# EAGLE design app_out_8x_16A_bistab_seperated_4MU_BOT_v1.0.0 (EAGLE 7.2.0)
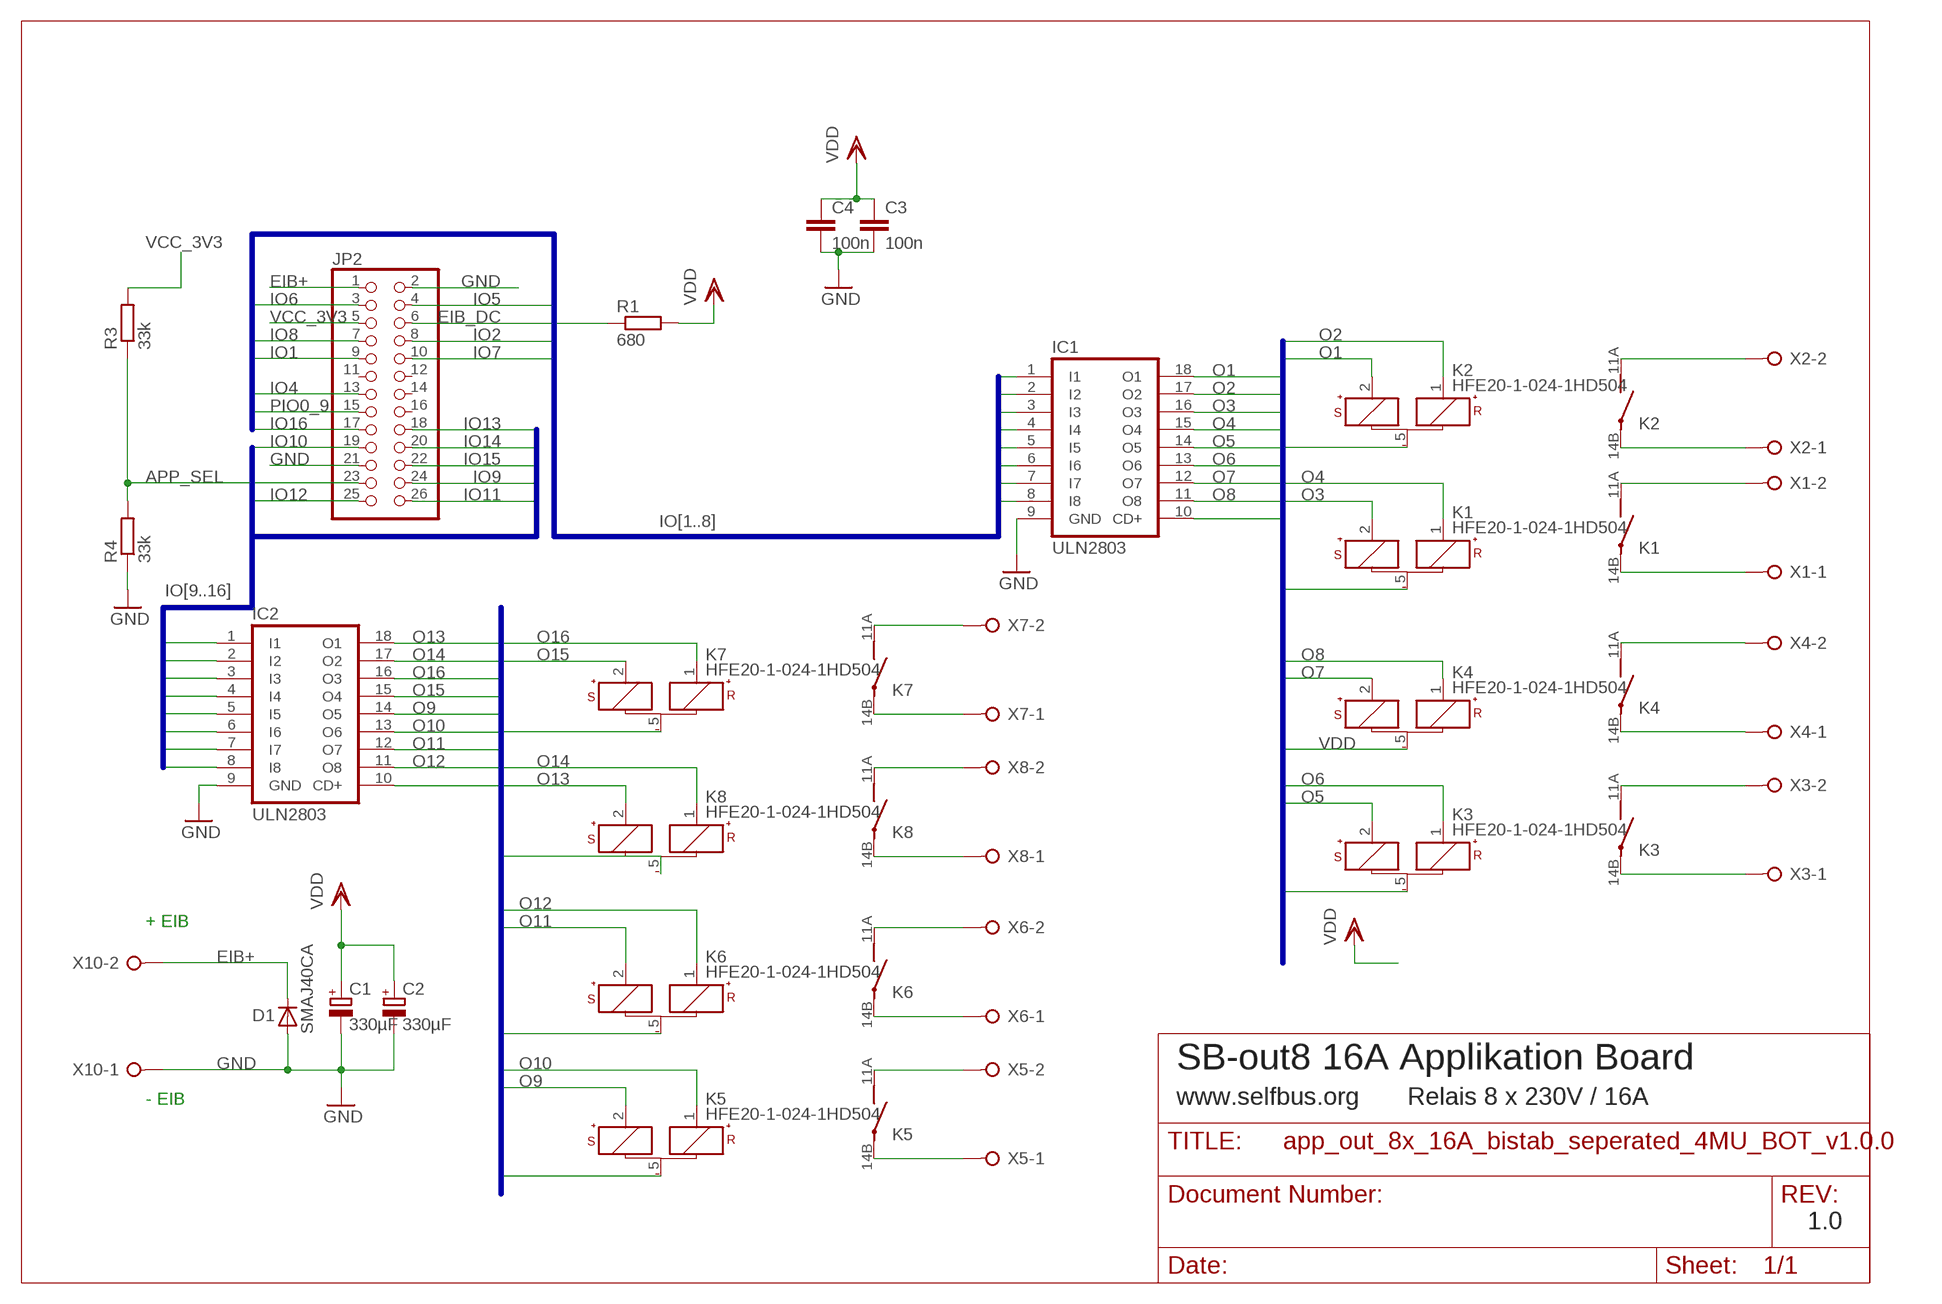
[diagram p0: schematic, sheet 1]

## Parts
C1  330µF  CPOL-EUE3.5-8  [E3,5-8]
C2  330µF  CPOL-EUE3.5-8  [E3,5-8]
C3  100n  C-EUC1206  [C1206]
C4  100n  C-EUC1206  [C1206]
D1  SMAJ40CA  D-SMB  [SMB]
IC1  ULN2803  ULN2803ASOP18  [SO18W]
IC2  ULN2803  ULN2803ASOP18  [SO18W]
JP2  PINHD-2X13_2.54-SMD  [2X13SMD]
K1  HFE20-1-024-1HD504  [HFE20-3-504]
K2  HFE20-1-024-1HD504  [HFE20-3-504]
K3  HFE20-1-024-1HD504  [HFE20-3-504]
K4  HFE20-1-024-1HD504  [HFE20-3-504]
K5  HFE20-1-024-1HD504  [HFE20-3-504]
K6  HFE20-1-024-1HD504  [HFE20-3-504]
K7  HFE20-1-024-1HD504  [HFE20-3-504]
K8  HFE20-1-024-1HD504  [HFE20-3-504]
R1  680  R-EU_M1206  [M1206]
R3  33k  R-EU_M1206  [M1206]
R4  33k  R-EU_M1206  [M1206]
X1  W237-02P  [W237-132]
X2  W237-02P  [W237-132]
X3  W237-02P  [W237-132]
X4  W237-02P  [W237-132]
X5  W237-02P  [W237-132]
X6  W237-02P  [W237-132]
X7  W237-02P  [W237-132]
X8  W237-02P  [W237-132]
X10  W237-02P  [W237-132]

## Nets
APP_SEL: JP2.23 R3.1 R4.2
EIB+: D1.1(C) JP2.1 X10.2
EIB_DC: JP2.6 R1.1
GND: C1.- C2.- C3.2 C4.2 D1.2(A) IC1.9(GND) IC2.9(GND) JP2.2 JP2.21 R4.1 X10.1
IO1: IC1.5(I5) JP2.9
IO2: IC1.4(I4) JP2.8
IO4: IC1.8(I8) JP2.13
IO5: IC1.1(I1) JP2.4
IO6: IC1.2(I2) JP2.3
IO7: IC1.6(I6) JP2.10
IO8: IC1.3(I3) JP2.7
IO9: IC2.5(I5) JP2.24
IO10: IC2.6(I6) JP2.19
IO11: IC2.7(I7) JP2.26
IO12: IC2.8(I8) JP2.25
IO13: IC2.1(I1) JP2.18
IO14: IC2.2(I2) JP2.20
IO15: IC2.4(I4) JP2.22
IO16: IC2.3(I3) JP2.17
K12: K2.14B(PA) X2.1
K34: K4.14B(PA) X4.1
K56: K6.11A(PB) X6.2
K78: K7.11A(PB) X7.2
N$1: K4.11A(PB) X4.2
N$2: K7.14B(PA) X7.1
N$3: K1.14B(PA) X1.1
N$4: K3.14B(PA) X3.1
N$5: K8.14B(PA) X8.1
N$6: K5.14B(PA) X5.1
N$7: K1.11A(PB) X1.2
N$8: K2.11A(PB) X2.2
N$9: K3.11A(PB) X3.2
N$11: K8.11A(PB) X8.2
N$13: K5.11A(PB) X5.2
N$14: K6.14B(PA) X6.1
O1: IC1.18(O1) K2.2(S+)
O2: IC1.17(O2) K2.1(R+)
O3: IC1.16(O3) K1.2(S+)
O4: IC1.15(O4) K1.1(R+)
O5: IC1.14(O5) K3.2(S+)
O6: IC1.13(O6) K3.1(R+)
O7: IC1.12(O7) K4.2(S+)
O8: IC1.11(O8) K4.1(R+)
O9: IC2.14(O5) K5.2(S+)
O10: IC2.13(O6) K5.1(R+)
O11: IC2.12(O7) K6.2(S+)
O12: IC2.11(O8) K6.1(R+)
O13: IC2.18(O1) K8.2(S+)
O14: IC2.17(O2) K8.1(R+)
O15: IC2.15(O4) K7.2(S+)
O16: IC2.16(O3) K7.1(R+)
PIO0_9: IC1.7(I7) JP2.15
VCC_3V3: JP2.5 R3.2
VDD: C1.+ C2.+ C3.1 C4.1 IC1.10(CD+) IC2.10(CD+) K1.5(-) K2.5(-) K3.5(-) K4.5(-) K5.5(-) K6.5(-) K7.5(-) K8.5(-) R1.2
Unconnected: JP2.11 JP2.12 JP2.14 JP2.16

## Buses
IO[1..8]
O[1..8],VDD
O[9..16],VDD
IO[9..16]

## Notes on the sheet
- + EIB
- SB-out8 16A Applikation Board
- - EIB | www.selfbus.org | Relais 8 x 230V / 16A
- 1.0

## Library data of the parts
C1 C2 = rcl:CPOL-EU: POLARIZED CAPACITOR, European symbol
C3 C4 = rcl:C-EU: CAPACITOR, European symbol
D1 = semicon-smd-ipc:D-: DIODE unfilled
IC1 IC2 = uln-udn:ULN2803A: DRIVER ARRAY
JP2 = pinhead:PINHD-2X13: PIN HEADER
K1-K8 = sb-relay:HFE20-1-024-1HD
R1 R3 R4 = rcl:R-EU_: RESISTOR, European symbol
X1-X8 X10 = con-wago-508:W237-02P: WAGO SREW CLAMP; OC_FARNELL: unknown; OC_NEWARK: unknown

## Net classes
1 230Vac: width 1.93 mm, clearance 5.08 mm to class 0, clearance 1.905 mm

## Board
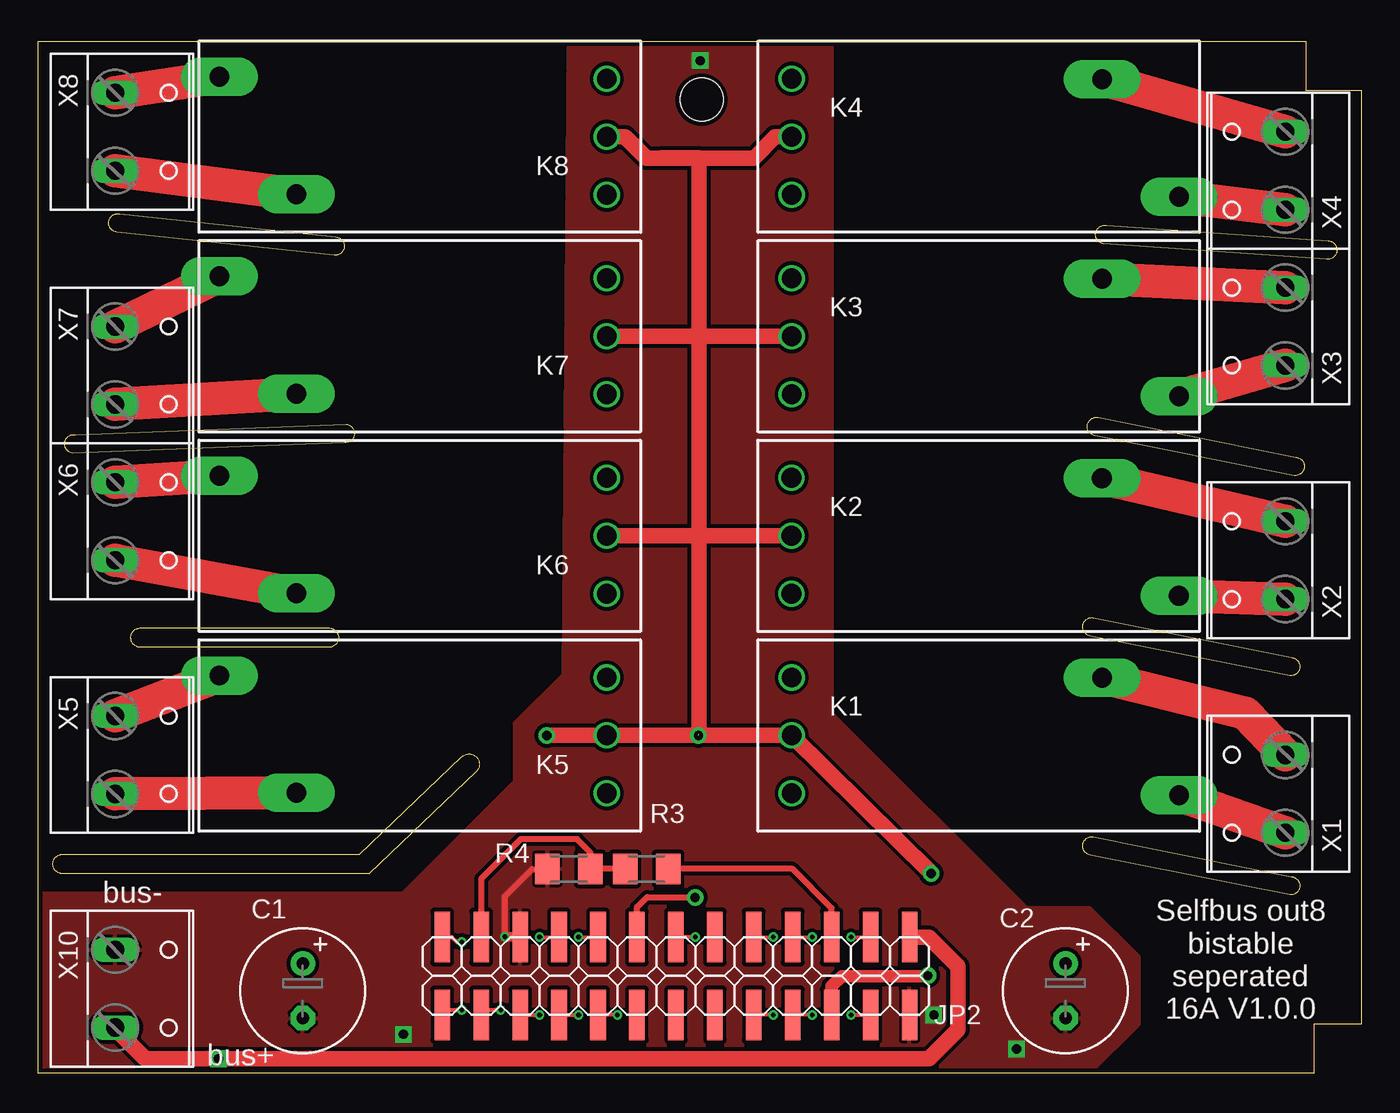
[diagram p1: board, top side]
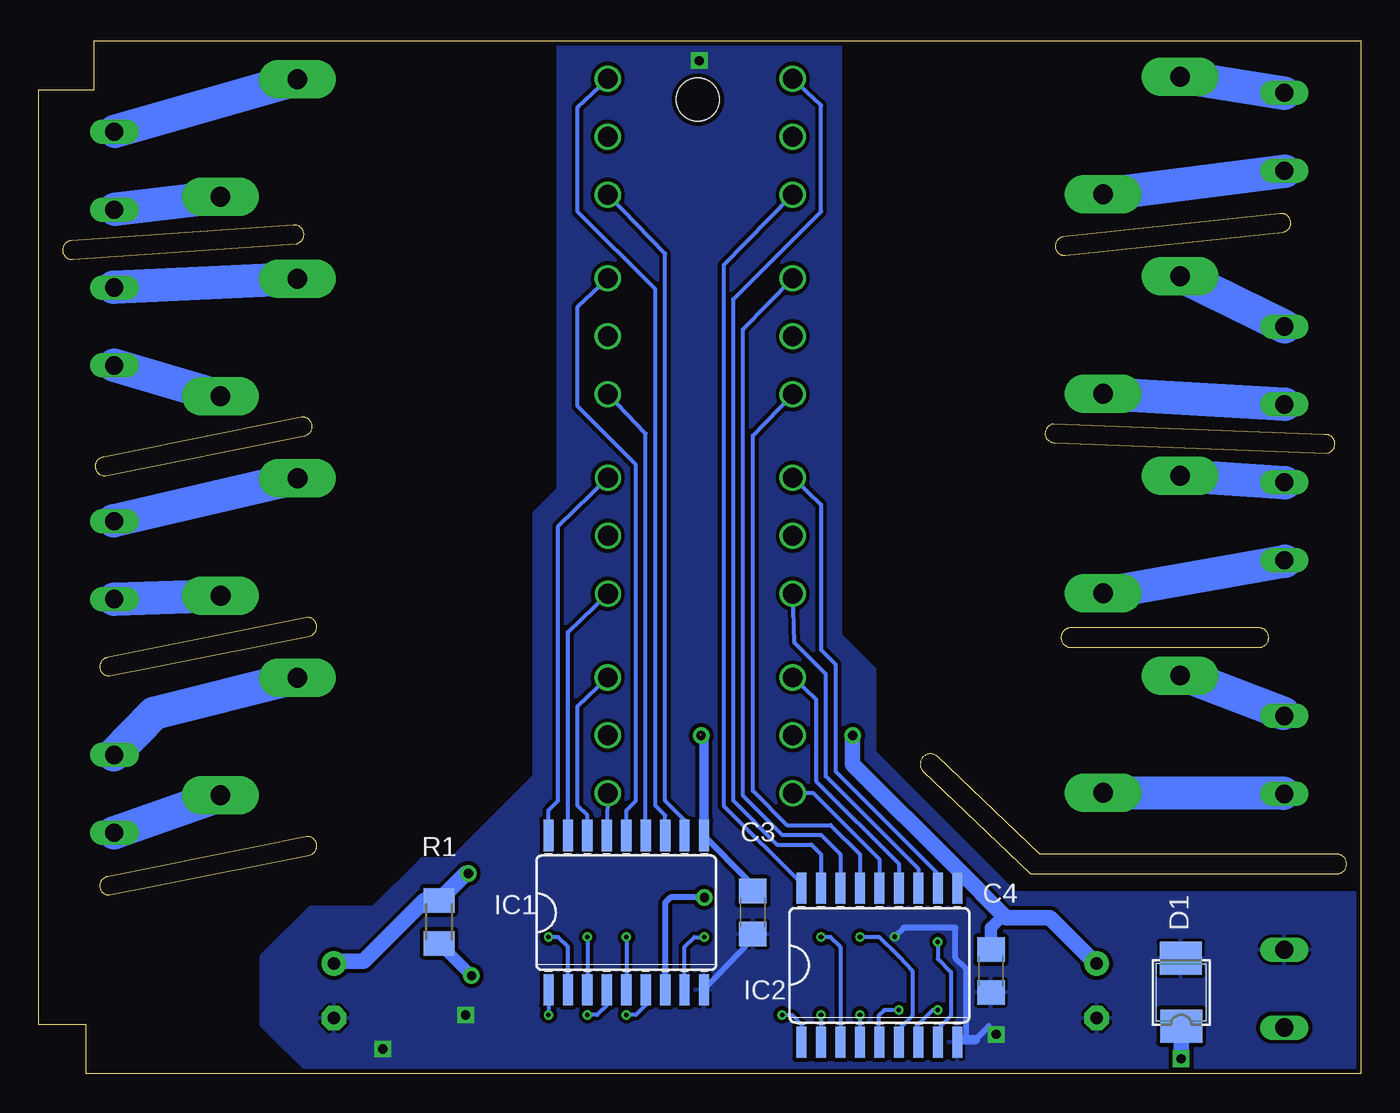
[diagram p2: board, bottom side, seen from below]

Size 86.3 x 67.31 mm. Coordinates in mm from the lower left corner, seen from the top.
Outline: 0.95,13.65 arc-90 1.59,14.29 20.95,14.29 27.62,20.64 arc-180 28.57,19.68 21.59,13.02 1.59,13.02 arc-90 0.95,13.65
Outline: 0,0 0,67.31 82.7,67.31 82.7,64.1 86.3,64.1 86.3,3.2 83.2,3.2 83.2,0 0,0
Outline: 2.42,41.65 20.07,42.34 arc-180 19.97,41.13 2.22,40.45 arc-180 2.42,41.65
Outline: 69.68,55.3 84.17,54.29 arc-180 84.07,53.09 69.48,54.1 arc-180 69.68,55.3
Outline: 6.03,28.41 arc-90 6.67,29.05 18.95,29.05 arc-90 19.58,28.41 arc-90 18.95,27.78 6.67,27.78 arc-90 6.03,28.41
Outline: 5.3,56.06 19.41,54.54 arc-180 19.3,53.34 5.1,54.86 arc-180 5.3,56.06
Outline: 68.84,29.72 81.74,27.12 arc-180 81.64,25.92 68.64,28.52 arc-180 68.84,29.72
Outline: 69.14,42.78 82.04,40.18 arc-180 81.94,38.98 68.94,41.58 arc-180 69.14,42.78
Outline: 68.84,15.43 81.74,12.83 arc-180 81.64,11.63 68.64,14.23 arc-180 68.84,15.43
Copper layers (1*16): Top 0.035mm / dielectric 1.5mm / Bottom 0.035mm
Design rules "PCB-POOL Standard *": minimum track width 0.15mm, minimum drill 0.3mm, track to track 0.15mm, track to pad 0.15mm, pad to pad 0.15mm, via to via 0.15mm, smd to smd 0.15mm, copper to edge 0.3mm, drill to drill 0.2mm, minimum pad ring 0.2mm, minimum via ring 0.15mm, stop-mask expansion 4mil, vias tented up to drill 0.7mm, thermal gap 0.2mm
Holes 2.8 mm at 43.27,63.49

### Footprints (pad centres in the part's own frame; a part is rotated, then mirrored left to right if it is on the bottom)
E3,5-8 = drill 0.813 pad 1.6: + -1.778,0 | drill 0.813 pad 1.6 octagon: - 1.778,0
C1206 = smd 1.6 x 1.8: 1 -1.4,0; 2 1.4,0
SMB = smd 2.159 x 2.743: 1 -2.311,-0.127; 2 2.108,-0.102
SO18W = smd 0.66 x 2.032: 1 -5.08,-5.029; 2 -3.81,-5.029; 3 -2.54,-5.029; 4 -1.27,-5.029; 5 0,-5.029; 6 1.27,-5.029; 7 2.54,-5.029; 8 3.81,-5.029; 9 5.08,-5.029; 10 5.08,5.029; 11 3.81,5.029; 12 2.54,5.029; 13 1.27,5.029; 14 0,5.029; 15 -1.27,5.029; 16 -2.54,5.029; 17 -3.81,5.029; 18 -5.08,5.029
2X13SMD = smd 1.016 x 3.302: 1 -1.27,-3.81; 2 -1.27,1.27; 3 1.27,-3.81; 4 1.27,1.27; 5 3.81,-3.81; 6 3.81,1.27; 7 6.35,-3.81; 8 6.35,1.27; 9 8.89,-3.81; 10 8.89,1.27; 11 11.43,-3.81; 12 11.43,1.27; 13 13.97,-3.81; 14 13.97,1.27; 15 16.51,-3.81; 16 16.51,1.27; 17 19.05,-3.81; 18 19.05,1.27; 19 21.59,-3.81; 20 21.59,1.27; 21 24.13,-3.81; 22 24.13,1.27; 23 26.67,-3.81; 24 26.67,1.27; 25 29.21,-3.81; 26 29.21,1.27
HFE20-3-504 = drill 1.3: 1 -12.6,-3.78; 2 -12.6,3.78; 5 -12.6,0 | drill 1.3 pad 2.5 long: 11A 7.65,3.75; 14B 12.67,-3.91
M1206 = smd 1.6 x 2: 1 -1.4,0; 2 1.4,0
W237-132 = drill 1.194 long: 1 -2.54,-0.635; 2 2.54,-0.635

### Placement (x,y rotation side)
C1  17.25,5.37 270 top
C2  67.02,5.38 270 top
C3  39.69,10.48 270 bottom
C4  24.15,6.67 270 bottom
D1  11.87,5.39 90 bottom
IC1  47.94,10.48 0 bottom
IC2  31.43,7.05 0 bottom
JP2  55.56,5.08 180 top
K1  61.75,22.03 0 top
K2  61.75,35.05 0 top
K3  61.75,48.07 0 top
K4  61.75,61.09 0 top
K5  24.48,22.03 180 top
K6  24.48,35.05 180 top
K7  24.48,48.07 180 top
K8  24.49,61.09 180 top
R1  60.15,9.87 90 bottom
R3  39.69,13.34 0 top
R4  34.61,13.34 0 top
X1  80.71,18.22 90 top
X2  80.71,33.46 90 top
X3  80.71,48.7 90 top
X4  80.71,58.86 90 top
X5  5.65,20.76 270 top
X6  5.65,36 270 top
X7  5.65,46.16 270 top
X8  5.65,61.4 270 top
X10  5.65,5.52 270 top

### Tracks (layer width: path | path; a pad name or v marks a point on that pad's centre or on a via)
APP_SEL
  Top 0.406: R3.1 R4.2 36.01,14.41 35.15,15.27 31.46,15.27 28.89,12.7 JP2.23
EIB+  (via drill 0.6)
  Top 1.016: JP2.1 58.1,8.89 60.01,6.99 60.01,2.86 58.1,0.95 v11.75,0.95 6.99,0.95 5.02,2.92 X10.2
  Bottom 1.016: D1.1 v11.74,0.96 v11.75,0.95
EIB_DC  (via drill 0.6)
  Top 0.61: 58.01,6.34 v58.04,6.37
  Top 0.813: 51.75,3.17 JP2.6 51.75,5.67 52.42,6.34 58.01,6.34
  Bottom 0.813: R1.1 60.15,8.48 v58.04,6.37
GND  (via drill 0.3, 0.6)
  Top 0.406: v30.44,8.91 30.44,11.55 32.2,13.31 33.19,13.31 R4.1
  Top 0.61: v30.44,8.91 31.41,8.91 JP2.21
  Bottom 0.406: C3.2 39.78,8.66 IC1.9 | 26.13,2.24 IC2.9 26.19,2.19 | v30.43,8.91 v30.44,8.91 29.84,9.51 26.49,9.51 26.46,9.48 26.46,7.51 25.75,6.81 25.75,2.2 25.74,2.19 | 24.29,3.08 25.18,2.19
  Bottom 0.61: 26.19,2.19 25.74,2.19 25.18,2.19
  other vias: 58.42,3.81 23.81,2.54 63.82,1.59 43.18,66.04
  pour Top (isolate 0.254): 34.61,67.31 51.75,67.31 51.75,23.5 64.45,10.79 68.58,10.79 71.75,7.62 71.75,3.17 68.58,0 0,0 0,11.75 23.81,11.75 31.11,19.05 31.11,22.86 34.29,26.04
  pour Bottom (isolate 0.254): 33.97,67.31 52.39,67.31 52.39,38.1 53.98,36.51 53.98,19.37 59.37,13.97 61.28,13.97 64.45,10.79 68.58,10.79 71.75,7.62 71.75,3.17 68.58,0 0,0 0,11.75 22.54,11.75 31.75,20.95 31.75,26.35 33.97,28.57
IO1  (via drill 0.3)
  Top 0.254: JP2.9 v47.94,8.89
  Bottom 0.254: v47.94,8.89 IC1.5
IO2  (via drill 0.3)
  Top 0.254: v50.48,3.81 JP2.8
  Bottom 0.254: IC1.4 49.21,4.45 49.85,3.81 v50.48,3.81
IO4  (via drill 0.3)
  Top 0.254: v42.86,8.89 JP2.13
  Bottom 0.254: IC1.8 44.13,8.26 43.5,8.89 v42.86,8.89
IO5  (via drill 0.3)
  Top 0.254: v53.02,3.81 JP2.4
  Bottom 0.254: IC1.1 v53.02,3.81
IO6  (via drill 0.3)
  Top 0.254: v53.02,8.89 JP2.3
  Bottom 0.254: IC1.2 51.75,8.26 52.39,8.89 v53.02,8.89
IO7  (via drill 0.3)
  Top 0.254: v47.94,3.81 JP2.10
  Bottom 0.254: IC1.6 46.67,4.45 47.31,3.81 v47.94,3.81
IO8  (via drill 0.3)
  Top 0.254: JP2.7 v50.48,8.89
  Bottom 0.254: v50.48,8.89 IC1.3
IO9  (via drill 0.3)
  Top 0.254: v30.16,4.12 29.21,4.12 JP2.24
  Bottom 0.254: v30.16,4.12 31.12,4.12 31.48,3.76 31.48,2.07 IC2.5
IO10  (via drill 0.3)
  Top 0.254: v32.7,8.89 JP2.19
  Bottom 0.254: v32.7,8.89 31.43,8.89 30.16,7.62 29.28,6.67 29.28,3.76 30.22,2.81 30.22,2.08 IC2.6
IO11  (via drill 0.3)
  Top 0.254: v27.62,4.12 26.67,4.12 JP2.26
  Bottom 0.254: v27.62,4.12 27.97,4.12 28.96,3.13 28.96,2.09 IC2.7
IO12  (via drill 0.3)
  Top 0.254: JP2.25 26.97,8.89 27.29,8.57 v27.62,8.57
  Bottom 0.254: v27.62,8.57 27.62,7.46 26.76,6.59 26.76,3.76 27.7,2.81 27.7,2.1 IC2.8
IO13  (via drill 0.3)
  Top 0.254: v37.78,3.81 JP2.18
  Bottom 0.254: v37.78,3.81 37.15,3.81 36.51,3.17 IC2.1
IO14  (via drill 0.3)
  Top 0.254: JP2.20 v35.24,3.81
  Bottom 0.254: v35.24,3.81 IC2.2
IO15  (via drill 0.3)
  Top 0.254: JP2.22 v32.7,3.81
  Bottom 0.254: v32.7,3.81 IC2.4
IO16  (via drill 0.3)
  Top 0.254: v35.24,8.89 JP2.17
  Bottom 0.254: v35.24,8.89 34.61,8.89 33.97,8.26 IC2.3
K12
  Top 2.184: K2.14B X2.1
K34
  Top 2.184: K4.14B X4.1
  Bottom 2.184: K4.14B 81.28,56.36
K56
  Top 2.184: X6.2 K6.11A
K78
  Top 2.184: X7.2 K7.11A
N$1
  Top 2.184: X4.2 K4.11A
  Bottom 2.184: K4.11A 81.28,61.44
N$2
  Top 2.184: X7.1 K7.14B
N$3
  Top 2.184: K1.14B X1.1
  Bottom 2.184: X1.1 74.45,18.1
N$4
  Top 2.184: K3.14B X3.1
N$5
  Top 2.184: X8.1 K8.14B
N$6
  Top 2.184: X5.1 K5.14B
N$7
  Top 2.184: K1.11A 78.74,23.5 X1.2
N$8
  Top 2.184: K2.11A X2.2
N$9
  Top 2.184: K3.11A X3.2
N$10
  Bottom 2.184: 11.75,26.04 5.08,23.5
N$11
  Top 2.184: X8.2 K8.11A
N$13
  Top 2.184: X5.2 K5.11A
  Bottom 2.184: K5.11A 5.08,18.26
N$14
  Top 2.184: K6.14B X6.1
N$43
  Bottom 2.184: 4.98,43.62 16.74,44.31
N$44
  Bottom 2.184: 4.99,48.68 11.71,51.99
N$45
  Bottom 2.184: 4.98,58.84 16.75,57.34
N$46
  Bottom 2.184: 4.99,38.53 11.72,38.97
N$47
  Bottom 2.184: 4.99,33.41 16.74,31.3
N$48
  Bottom 2.184: 5.01,63.92 11.74,65
N$49
  Bottom 2.184: 69.5,51.81 81.37,51.27
N$50
  Bottom 2.184: 81.36,46.18 74.51,44.17
N$51
  Bottom 2.184: 81.37,36.03 69.5,38.81
N$52
  Bottom 2.184: 74.5,31.13 81.36,30.93
N$53
  Bottom 2.184: 69.5,25.78 78.74,23.49 81.37,20.77
O1
  Bottom 0.254: IC1.18 53.02,17.14 52.39,17.78 52.39,35.69 K2.2
O2
  Bottom 0.254: IC1.17 51.75,28.77 K2.1
O3
  Bottom 0.254: IC1.16 50.48,16.83 51.12,17.46 51.12,23.95 K1.2
O4
  Bottom 0.254: K1.1 49.25,15.54 IC1.15
O5
  Bottom 0.254: IC1.14 47.94,17.14 47.31,17.78 47.31,39.69 51.12,43.5 51.12,49.98 K3.2
O6
  Bottom 0.254: IC1.13 46.67,41.71 K3.1
O7
  Bottom 0.254: IC1.12 45.4,16.83 46.04,17.46 46.04,51.12 51.12,56.2 51.12,63 K4.2
O8
  Bottom 0.254: IC1.11 44.13,16.51 45.4,17.78 45.4,53.46 K4.1
O9
  Bottom 0.254: K5.2 35.72,18.25 31.43,13.97 IC2.14
O10
  Bottom 0.254: K5.1 35.56,24.39 35.56,19.05 30.16,13.65 IC2.13
O11
  Bottom 0.254: K6.2 36.98,28.09 34.92,26.04 34.92,19.37 28.89,13.34 IC2.12
O12
  Bottom 0.254: K6.1 35.24,37.09 35.24,27.62 34.29,26.67 34.29,19.68 27.62,13.02 IC2.11
O13
  Bottom 0.254: IC2.18 36.48,12.35 41.59,17.46 41.59,52.7 K8.2
O14
  Bottom 0.254: IC2.17 35.24,14.29 35.88,14.92 38.1,14.92 40.96,17.78 40.96,50.48 35.24,56.2 35.24,63.12 K8.1
O15
  Bottom 0.254: IC2.15 32.7,14.29 34.61,16.19 37.47,16.19 39.69,18.41 39.69,41.59 K7.2
O16
  Bottom 0.254: IC2.16 33.97,14.29 35.24,15.56 37.78,15.56 40.32,18.1 40.32,48.51 K7.1
PIO0_9  (via drill 0.6)
  Top 0.406: JP2.15 39.05,10.84 39.72,11.5 42.85,11.5 v42.85,11.47
  Bottom 0.406: 45.39,5.46 IC1.7 45.4,11.11 45.04,11.47 v42.85,11.47
VCC_3V3
  Top 0.406: JP2.5 51.75,10.77 49.16,13.36 41.11,13.36 R3.2
VDD  (via drill 0.6)  (1 unrouted)
  Top 0.406: 36.98,22.04 K5.5
  Top 1.016: K6.5 43.1,35.05 | K5.5 v43.06,22.04 K1.5 v58.25,13.03 | v33.18,22.04 36.98,22.04 | K4.5 48.07,61.09 46.67,59.69 40.64,59.69 | 40.64,59.69 39.69,59.69 38.29,61.09 K8.5 | 43.1,22.1 43.1,35.05 | 43.1,35.05 43.1,48.26 | 43.1,48.26 43.1,59.7 40.65,59.7 arc90 40.64,59.69 | 43.1,48.26 arc90 43.29,48.07 K3.5 | 43.1,48.26 arc-90 42.91,48.07 K7.5 | K2.5 43.1,35.05
  Bottom 0.406: IC1.10 40.01,12.6 C3.1
  Bottom 0.61: IC1.10 42.86,21.83 v43.06,22.04 | IC2.10 26.35,13.34
  Bottom 0.813: C4.1 24.15,9.51 23.34,10.32
  Bottom 1.016: v58.25,13.03 58.39,13.03 R1.2 61.12,11.28 65.09,7.3 66.87,7.3 C2.+ | C1.+ 17.31,7.15 20.32,10.16 23.18,10.16 23.34,10.32 26.35,13.34 33.18,20.16 v33.18,22.04

### Text on the board
tPlace: Selfbus out8 / bistable / seperated / 16A V1.0.0
tNames: bus- | bus+